# EasyEDA schematic SCH_O driver_2023-08-17.json
TITLE: Sheet_1; REV: 1.0; Date: 2023-07-29; Sheet: 1/1; Drawn By: shubhamprajapati5636; Company: Your Company
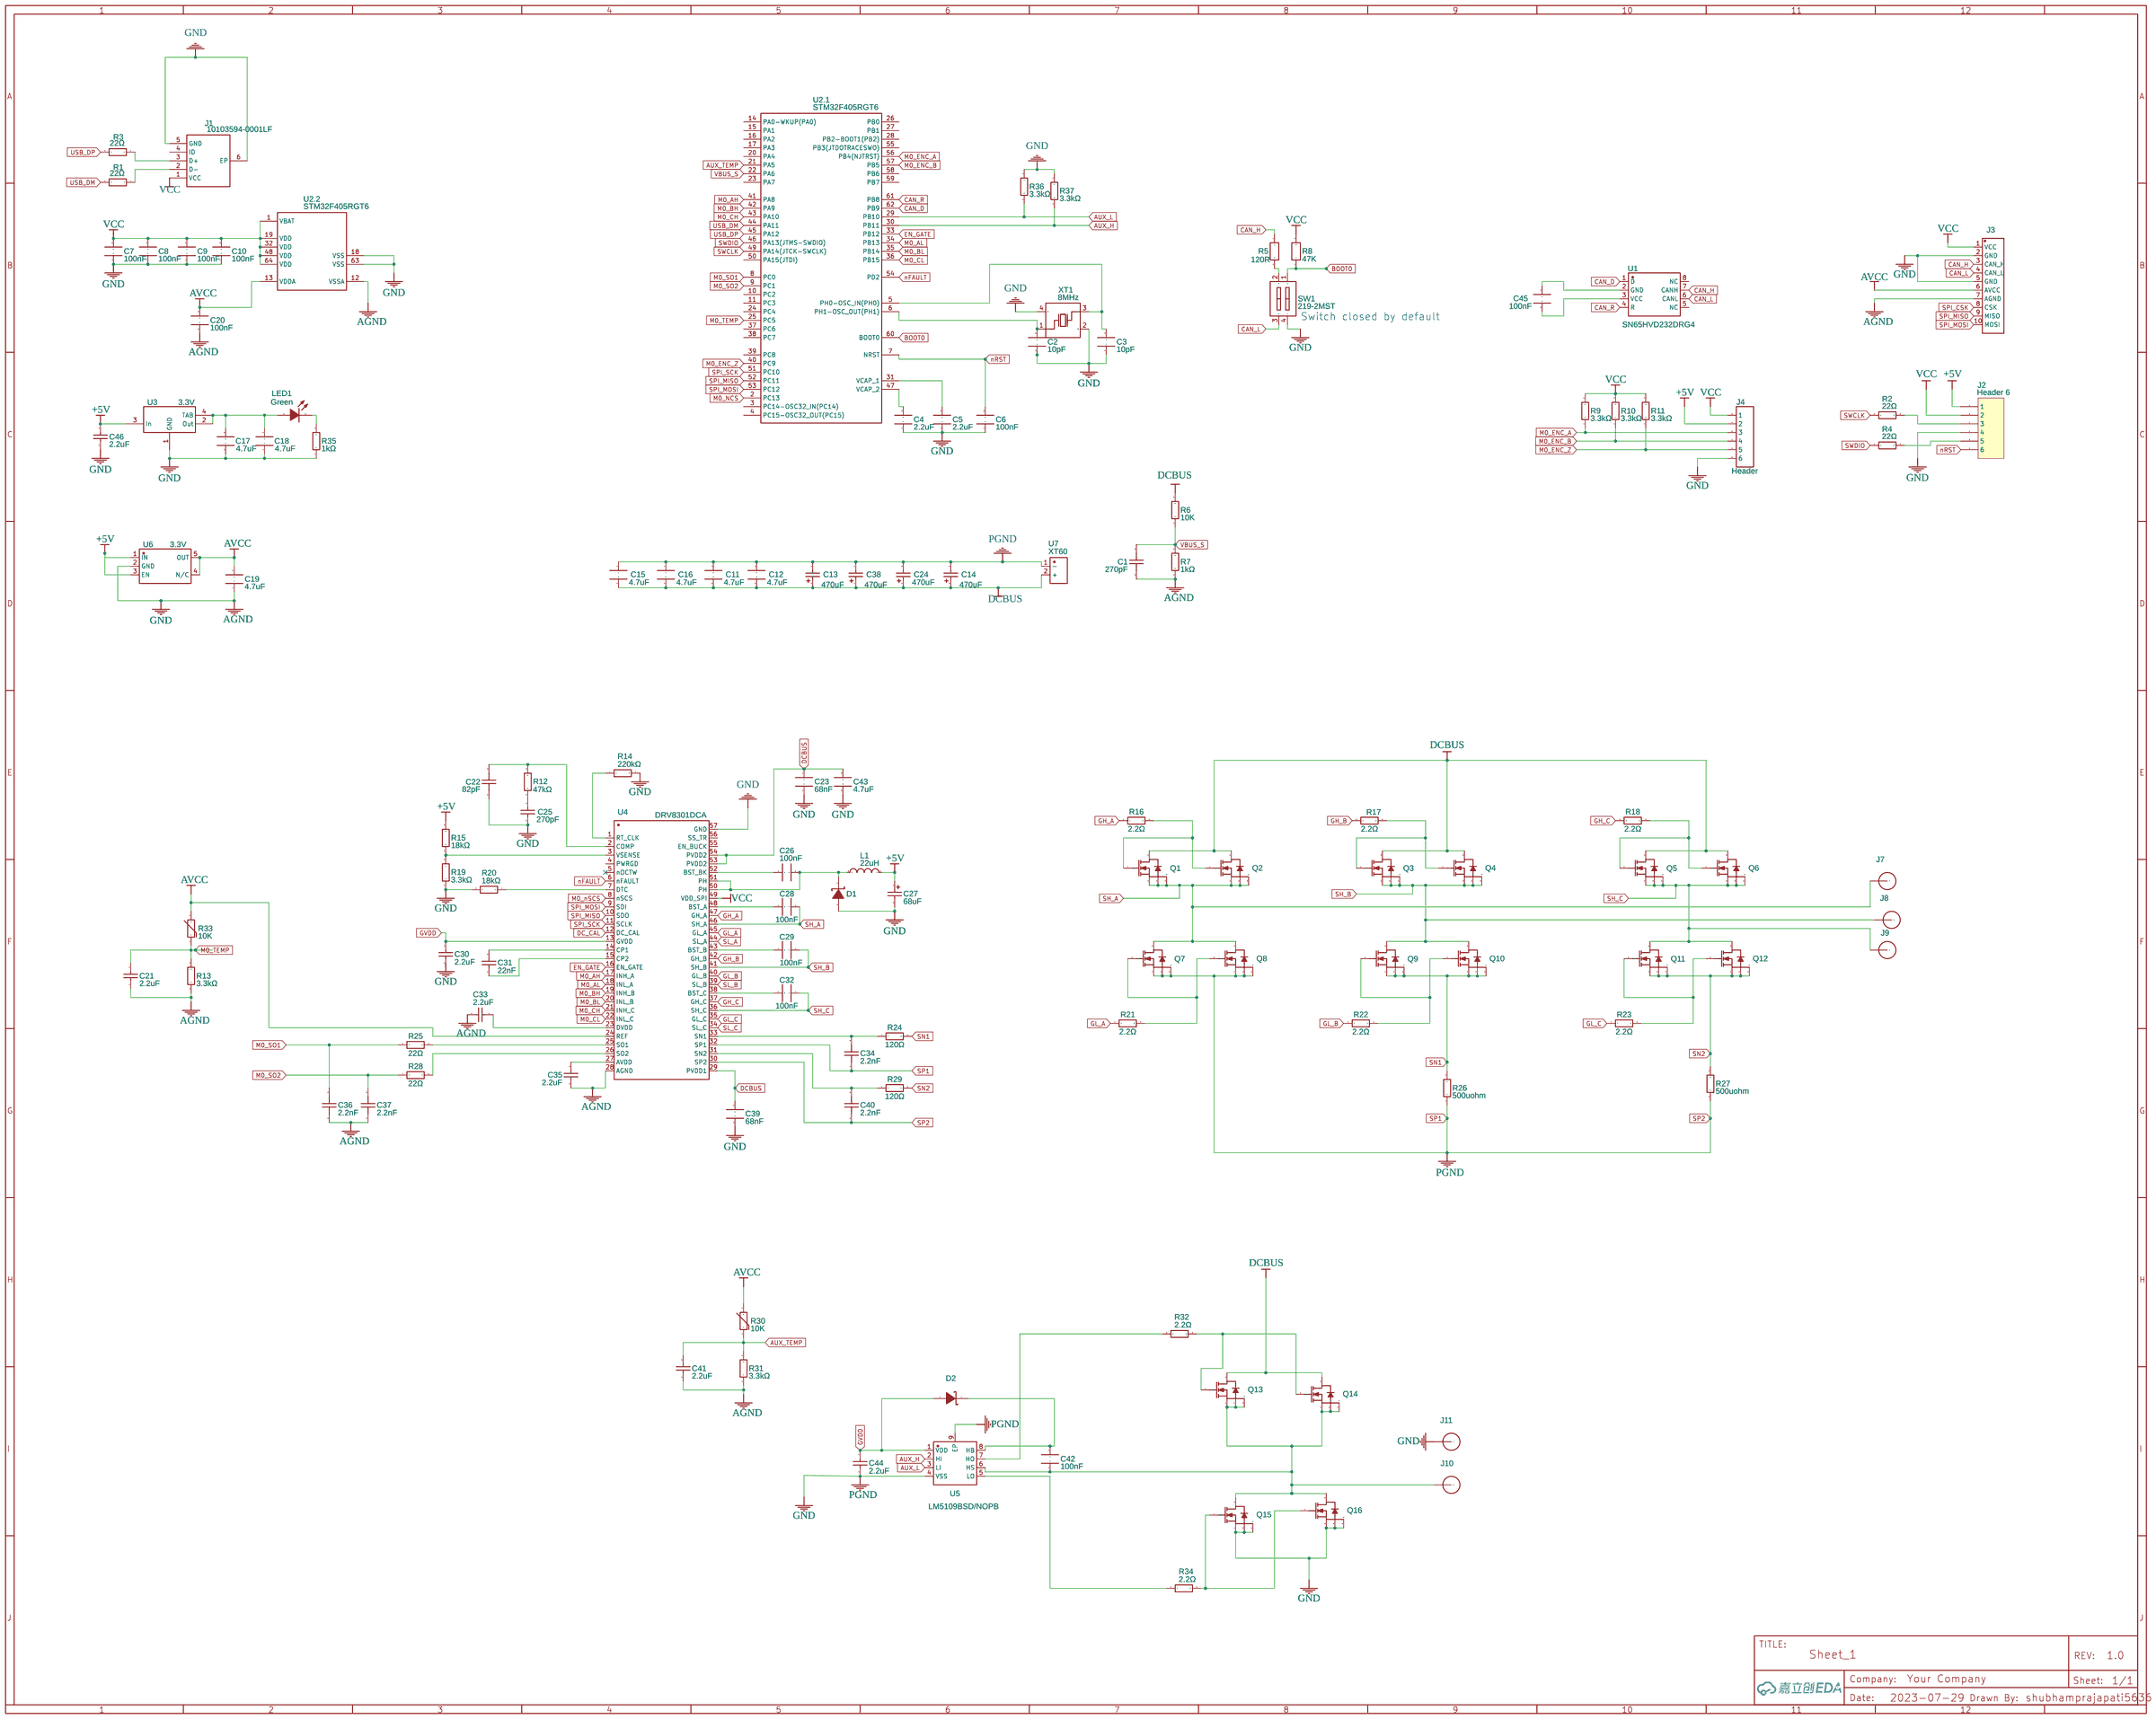
[diagram p0: schematic sheet]

## Parts
C1  270pF  [C0603]
C2  10pF  [CAPC1608X09L]
C3  10pF  [CAPC1608X09L]
C4  2.2uF  [CAPC1608X09L]
C5  2.2uF  [CAPC1608X09L]
C6  100nF  [CAPC1608X09L]
C7  100nF  [CAPC1608X09L]
C8  100nF  [CAPC1608X09L]
C9  100nF  [CAPC1608X09L]
C10  100nF  [CAPC1608X09L]
C11  4.7uF  [CAPC2012X09N]
C12  4.7uF  [CAPC2012X09N]
C13  470uF  [CAP_ELEC_SIZE_G 10.0X10.2MM]
C14  470uF  [CAP_ELEC_SIZE_G 10.0X10.2MM]
C15  4.7uF  [CAPC2012X09N]
C16  4.7uF  [CAPC2012X09N]
C17  4.7uF  [CAPC2012X09N]
C18  4.7uF  [CAPC2012X09N]
C19  4.7uF  [CAPC2012X09N]
C20  100nF  [CAPC1608X09L]
C21  2.2uF  [C0603]
C22  82pF  [C0603]
C23  68nF  [CAPC1608X09L]
C24  470uF  [CAP_ELEC_SIZE_G 10.0X10.2MM]
C25  270pF  [C0603]
C26  100nF  [CAPC1608X09L]
C27  68uF  [CAP-SMD_L6.0-W3.2-R-RD]
C28  100nF  [CAPC1608X09L]
C29  100nF  [CAPC1608X09L]
C30  2.2uF  [C0603]
C31  22nF  [C0603]
C32  100nF  [CAPC1608X09L]
C33  2.2uF  [C0603]
C34  2.2nF  [C0603]
C35  2.2uF  [C0603]
C36  2.2nF  [C0603]
C37  2.2nF  [C0603]
C38  470uF  [CAP_ELEC_SIZE_G 10.0X10.2MM]
C39  68nF  [CAPC1608X09L]
C40  2.2nF  [C0603]
C41  2.2uF  [C0603]
C42  100nF  [CAPC1608X09L]
C43  4.7uF  [CAPC2012X09N]
C44  2.2uF  [C0603]
C45  100nF  [CAPC1608X09L]
C46  2.2uF  [C0603]
D1  MBR140SFT1G  [SOD-123F_L2.8-W1.8-LS3.7-RD]
D2  MBR140SFT1G  [SOD-123F_L2.8-W1.8-LS3.7-RD]
J1  10103594-0001LF  [MICRO-USB-SMD_10103594-0001LF]
J2  Header 6  [HDR1X6]
J3  1.27mm1*10P Straight Headers  Pins  [HDR-TH_10P-P1.27-V-M-1]
J4  Header  [HDR-TH_6P-P2.54-V-M-1]
J7  M3 SCREW HOLE PAD  [M3 SPADE HOLE]
J8  M3 SCREW HOLE PAD  [M3 SPADE HOLE]
J9  M3 SCREW HOLE PAD  [M3 SPADE HOLE]
J10  M3 SCREW HOLE PAD  [M3 SPADE HOLE]
J11  M3 SCREW HOLE PAD  [M3 SPADE HOLE]
L1  22uH  [IND-SMD_L6.0-W6.0_ABG06A45]
LED1  Green  [LED0603-RD]
Q1  NTMFS5C628NLT3G  [DFN-5_L4.9-W5.9-P1.27-LS6.2-BL]
Q2  NTMFS5C628NLT3G  [DFN-5_L4.9-W5.9-P1.27-LS6.2-BL]
Q3  NTMFS5C628NLT3G  [DFN-5_L4.9-W5.9-P1.27-LS6.2-BL]
Q4  NTMFS5C628NLT3G  [DFN-5_L4.9-W5.9-P1.27-LS6.2-BL]
Q5  NTMFS5C628NLT3G  [DFN-5_L4.9-W5.9-P1.27-LS6.2-BL]
Q6  NTMFS5C628NLT3G  [DFN-5_L4.9-W5.9-P1.27-LS6.2-BL]
Q7  NTMFS5C628NLT3G  [DFN-5_L4.9-W5.9-P1.27-LS6.2-BL]
Q8  NTMFS5C628NLT3G  [DFN-5_L4.9-W5.9-P1.27-LS6.2-BL]
Q9  NTMFS5C628NLT3G  [DFN-5_L4.9-W5.9-P1.27-LS6.2-BL]
Q10  NTMFS5C628NLT3G  [DFN-5_L4.9-W5.9-P1.27-LS6.2-BL]
Q11  NTMFS5C628NLT3G  [DFN-5_L4.9-W5.9-P1.27-LS6.2-BL]
Q12  NTMFS5C628NLT3G  [DFN-5_L4.9-W5.9-P1.27-LS6.2-BL]
Q13  NTMFS5C628NLT3G  [DFN-5_L4.9-W5.9-P1.27-LS6.2-BL]
Q14  NTMFS5C628NLT3G  [DFN-5_L4.9-W5.9-P1.27-LS6.2-BL]
Q15  NTMFS5C628NLT3G  [DFN-5_L4.9-W5.9-P1.27-LS6.2-BL]
Q16  NTMFS5C628NLT3G  [DFN-5_L4.9-W5.9-P1.27-LS6.2-BL]
R1  22Ω  [R0603]
R2  22Ω  [R0603]
R3  22Ω  [R0603]
R4  22Ω  [R0603]
R5  120R  [R0603]
R6  10K  [R0603]
R7  1kΩ  [R0603]
R8  47K  [R0603]
R9  3.3kΩ  [R0603]
R10  3.3kΩ  [R0603]
R11  3.3kΩ  [R0603]
R12  47kΩ  [R0603]
R13  3.3kΩ  [R0603]
R14  220kΩ  [R0603]
R15  18kΩ  [R0603]
R16  2.2Ω  [R0603]
R17  2.2Ω  [R0603]
R18  2.2Ω  [R0603]
R19  3.3kΩ  [R0603]
R20  18kΩ  [R0603]
R21  2.2Ω  [R0603]
R22  2.2Ω  [R0603]
R23  2.2Ω  [R0603]
R24  120Ω  [R0603]
R25  22Ω  [R0603]
R26  500uohm  [2512]
R27  500uohm  [2512]
R28  22Ω  [R0603]
R29  120Ω  [R0603]
R30  10K  [R0402]
R31  3.3kΩ  [R0603]
R32  2.2Ω  [R0603]
R33  10K  [R0402]
R34  2.2Ω  [R0603]
R35  1kΩ  [R0603]
R36  3.3kΩ  [R0603]
R37  3.3kΩ  [R0603]
SW1  219-2MST  [SW-SMD_219-2MST]
U1  SN65HVD232DRG4  [SOIC-8_L4.9-W3.9-P1.27-LS6.0-BL]
U2  STM32F405RGT6  [LQFP-64_L10.0-W10.0-P0.50-LS12.0-BL]  (sections 1,2)
U3  3.3V  [SOT-223-3_L6.4-W3.5-P2.30-LS7.0-BR]
U4  DRV8301DCA  [HTSSOP-56_L14.0-W6.0-P0.50-LS8.1-BL-EP]
U5  LM5109BSD/NOPB  [WSON-8_L4.0-W4.0-P0.80-TL-EP]
U6  3.3V  [SOT-23-5_L3.0-W1.7-P0.95-LS2.8-BR]
U7  XT60  [CONN-TH_XT60]
XT1  8MHz  [OSC-SMD_4P-L5.0-W3.2-BL]

## Library data of the parts
C1 = C_0603_US: Contributor: LCEDA_Lib
C2 C3 C23 C39 = GRM188R71H104KA93D: Supplier 1: Digi-Key; Supplier Part Number 1: 490-1519-2-ND; Manufacturer: Murata Electronics North America; RoHS: RoHS Compliant; Category: Capacitors; Pricing 1: 4000=0.01822, 8000=0.01663, 12000=0.01584 (USD); Packaging: Tape & Reel (TR); Capacitance: 0.1uF; Tolerance: ±10%; Voltage - Rated: 50V; Temperature Coefficient: X7R; Mounting Type: Surface Mount, MLCC; Operating Temperature: -55°C ~ 125°C; Applications: General Purpose; Package / Case: 0603 (1608 Metric); Size / Dimension: 0.063" L x 0.032" W (1.60mm x 0.80mm); Thickness (Max): 0.035" (0.90mm); ComponentLink1URL: http://www.murata.com/~/media/webrenewal/support/library/catalog/products/capacitor/mlcc/c02e.ashx?la=en-us; ComponentLink1Description: http://www.murata.com/~/media/webrenewal/support/library/catalog/products/capacitor/mlcc/c02e.ashx?la=en-us; Stock: 19812000; Part Status: Active; Supplier 2: Digi-Key; Supplier Part Number 2: 490-1519-1-ND; Pricing 2: 1=0.12, 10=0.084, 100=0.0396, 500=0.02778, 1000=0.023 (USD); Contributor: Colton Hillebrand
C4-C10 C20 C26 C28 C29 C32 C42 = GRM188R61C225KE15D: Supplier 1: Digi-Key; Supplier Part Number 1: 490-3296-1-ND; Manufacturer: Murata Electronics North America; RoHS: RoHS Compliant; Category: Capacitors; Stock 1: 1255740; Pricing 1: 1=0.12, 10=0.08, 50=0.046, 100=0.038, 250=0.032, 500=0.0268, 1000=0.022 (USD); Packaging: Cut Tape (CT); Capacitance: 2.2µF; Tolerance: ±10%; Voltage - Rated: 16V; Temperature Coefficient: X5R; Mounting Type: Surface Mount, MLCC; Operating Temperature: -55°C ~ 85°C; Applications: General Purpose; Package / Case: 0603 (1608 Metric); Size / Dimension: 0.063" L x 0.031" W (1.60mm x 0.80mm); Thickness (Max): 0.035" (0.90mm); ComponentLink1URL: http://www.murata.com/~/media/webrenewal/support/library/catalog/products/capacitor/mlcc/c02e.pdf; ComponentLink1Description: http://www.murata.com/~/media/webrenewal/support/library/catalog/products/capacitor/mlcc/c02e.pdf; Contributor: Colton Hillebrand
C11 C12 C15-C19 C43 = GRM219R6YA475KA73D: Supplier 1: Digi-Key; Supplier Part Number 1: 490-7208-2-ND; Manufacturer: Murata Electronics North America; RoHS: RoHS Compliant; Category: Capacitors; Pricing 1: 4000=0.05126, 8000=0.0487, 12000=0.04613 (USD); Packaging: Tape & Reel (TR); Part Status: Active; Tolerance: ±10%; Voltage - Rated: 35V; Temperature Coefficient: X5R; Operating Temperature: -55°C ~ 85°C; Features: Derating Recommended; Applications: General Purpose; Mounting Type: Surface Mount, MLCC; Package / Case: 0805 (2012 Metric); Size / Dimension: 0.079" L x 0.049" W (2.01mm x 1.25mm); Thickness (Max): 0.037" (0.95mm); ComponentLink1URL: http://www.murata.com/~/media/webrenewal/support/library/catalog/products/capacitor/mlcc/c02e.ashx?la=en-us; ComponentLink1Description: http://www.murata.com/~/media/webrenewal/support/library/catalog/products/capacitor/mlcc/c02e.ashx?la=en-us; Supplier 2: Digi-Key; Supplier Part Number 2: 490-7208-1-ND; Pricing 2: 1=0.26, 10=0.177, 100=0.1002, 500=0.07076, 1000=0.06191 (USD); Stock: 152000; Contributor: Colton Hillebrand
C13 C14 C24 C38 = Cap Alu: Contributor: Suhaimi Annuar
C21 C41 C46 = EMK107BJ225KA-T: Supplier: LCSC; Manufacturer: TAIYO YUDEN(太诱); Supplier Part: C92760; JLCPCB Part Class: Extended Part
C22 = GRM1885C2A820JA01D: Contributor: LCSC; Supplier: LCSC; Supplier Part: C184399; Manufacturer: muRata(村田); JLCPCB Part Class: Extended Part
C25 = GRM1885C1H271JA01D: Supplier: LCSC; Manufacturer: muRata(村田); Supplier Part: C97879; JLCPCB Part Class: Extended Part
C27 = T495C686M016ATE250: Contributor: LCSC; Supplier: LCSC; Manufacturer: KEMET(基美); Supplier Part: C122319; JLCPCB Part Class: Extended Part
C30 C33 C35 C44 = GRM188R61C225KE15D: Supplier: LCSC; Manufacturer: muRata(村田); Supplier Part: C77183; JLCPCB Part Class: Extended Part
C31 = GRM188R71H223KA01D: Supplier: LCSC; Manufacturer: muRata(村田); Supplier Part: C77056; JLCPCB Part Class: Extended Part
C34 C36 C37 C40 = GRM1885C1H222JA01D: Supplier: LCSC; Manufacturer: muRata(村田); Supplier Part: C77033; JLCPCB Part Class: Extended Part
C45 = GRM1885C1H100JA01D: Supplier 1: Digi-Key; Supplier Part Number 1: 490-1403-1-ND; Manufacturer: Murata Electronics North America; RoHS: RoHS Compliant; Category: Capacitors; Stock 1: 450321; Pricing 1: 1=0.1, 10=0.041, 50=0.0222, 100=0.0187, 250=0.01532, 500=0.0131, 1000=0.0102 (USD); Packaging: Cut Tape (CT); Capacitance: 10pF; Tolerance: ±5%; Voltage - Rated: 50V; Temperature Coefficient: C0G, NP0; Mounting Type: Surface Mount, MLCC; Operating Temperature: -55°C ~ 125°C; Applications: General Purpose; Package / Case: 0603 (1608 Metric); Size / Dimension: 0.063" L x 0.031" W (1.60mm x 0.80mm); Thickness (Max): 0.035" (0.90mm); ComponentLink1URL: http://www.murata.com/~/media/webrenewal/support/library/catalog/products/capacitor/mlcc/c02e.pdf; ComponentLink1Description: http://www.murata.com/~/media/webrenewal/support/library/catalog/products/capacitor/mlcc/c02e.pdf; Contributor: Colton Hillebrand
D1 D2 = MBR140SFT1G: Contributor: LCSC; Supplier: LCSC; Manufacturer: onsemi(安森美); Supplier Part: C43381; JLCPCB Part Class: Extended Part
J1 = 10103594-0001LF: Contributor: LCSC; Supplier: LCSC; Supplier Part: C428495; Manufacturer: Amphenol; JLCPCB Part Class: Extended Part
J2 = Header 6: Contributor: Scott Lee
J3 = 1.27mm1*10P Straight Headers  Pins: Supplier Part: C28952; Supplier: LCSC; Manufacturer: BOOMELE(博穆精密); JLCPCB Part Class: Extended Part
J4 = Header-Male-2.54_1x6: Supplier: LCSC; Manufacturer: BOOMELE(博穆精密); Supplier Part: C37208; JLCPCB Part Class: Extended Part
J7-J11 = M3 SCREW HOLE PAD: Contributor: Colton Hillebrand
L1 = NR6028T220M: Contributor: LCSC; Supplier: LCSC; Supplier Part: C45737; Manufacturer: TAIYO YUDEN(太诱); JLCPCB Part Class: Extended Part
LED1 = LTST-C190KGKT: Contributor: LCSC; Supplier: LCSC; Manufacturer: LITEON(光宝); Supplier Part: C125094; JLCPCB Part Class: Extended Part
Q1-Q16 = NTMFS5C628NLT3G: Contributor: LCSC; Supplier: LCSC; Supplier Part: C604443; Manufacturer: onsemi(安森美); JLCPCB Part Class: Extended Part
R1-R4 R25 R28 = RC0603FR-0722RL: Supplier: LCSC; Manufacturer: YAGEO(国巨); Supplier Part: C107701; JLCPCB Part Class: Extended Part
R5 R8 = R_0603_EU: Contributor: LCEDA_Lib
R6 R15 R20 = RC0603FR-0718KL: Supplier: LCSC; Manufacturer: YAGEO(国巨); Supplier Part: C114610; JLCPCB Part Class: Extended Part
R7 R35 = RC0603FR-071KL: Supplier: LCSC; Manufacturer: YAGEO(国巨); Supplier Part: C22548; JLCPCB Part Class: Extended Part
R9-R11 R13 R19 R31 R36 R37 = RC0603FR-073K3L: Supplier: LCSC; Manufacturer: YAGEO(国巨); Supplier Part: C108078; JLCPCB Part Class: Extended Part
R12 = RC0603FR-0747KL: Supplier: LCSC; Manufacturer: YAGEO(国巨); Supplier Part: C105579; JLCPCB Part Class: Extended Part
R14 = RC0603FR-07220KL: Supplier: LCSC; Manufacturer: YAGEO(国巨); Supplier Part: C123420; JLCPCB Part Class: Extended Part
R16-R18 R21-R23 R32 R34 = RC0603FR-072R2L: Supplier: LCSC; Manufacturer: YAGEO(国巨); Supplier Part: C112307; JLCPCB Part Class: Extended Part
R24 R29 = RC0603FR-07120RL: Supplier: LCSC; Manufacturer: YAGEO(国巨); Supplier Part: C114640; JLCPCB Part Class: Extended Part
R26 R27 = CSR2512C0R0005F: Supplier: Digi-Key; Supplier Part: 696-1183-1-ND; Manufacturer: Riedon; Contributor: LCSC
R30 R33 = NCP15XH103F03RC: Supplier: LCSC; Manufacturer: muRata(村田); Supplier Part: C77131; JLCPCB Part Class: Extended Part
SW1 = 219-2MST: Contributor: LCSC; Supplier: LCSC; Supplier Part: C314502; Manufacturer: CTS(西迪斯); JLCPCB Part Class: Extended Part
U1 = SN65HVD232DRG4: Contributor: LCSC; Supplier: LCSC; Supplier Part: C2671240; Manufacturer: TI(德州仪器); JLCPCB Part Class: Extended Part
U2 = STM32F405RGT6: tags: STM32; subpart_no: 1; image: http://image.lceda.cn/szlcsc/C15742.jpg; Supplier Part: C15742; Supplier: LCSC; Manufacturer: ST(意法半导体); JLCPCB Part Class: Extended Part
U3 = 1117-3.3: Contributor: lcsc; Supplier: LCSC; Supplier Part: C5125088; Manufacturer: IDCHIP(英锐芯); JLCPCB Part Class: Extended Part
U4 = DRV8301DCA: Contributor: LCSC; Supplier: LCSC; Supplier Part: C92113; Manufacturer: TI(德州仪器); JLCPCB Part Class: Extended Part
U5 = LM5109BSD/NOPB: Contributor: LCSC; Supplier: LCSC; Supplier Part: C544701; Manufacturer: TI(德州仪器); JLCPCB Part Class: Extended Part
U6 = LP5907MFX-3.3/NOPB: Contributor: LCSC; Supplier: LCSC; Supplier Part: C80670; Manufacturer: TI(德州仪器); JLCPCB Part Class: Extended Part
U7 = XT60: Contributor: lcsc; Supplier: LCSC; Supplier Part: C98733; Manufacturer: AMASS(艾迈斯); JLCPCB Part Class: Extended Part
XT1 = ABM3B-8.000MHZ-10-1-U-T: Contributor: LCSC; Supplier: LCSC; Supplier Part: C276420; Manufacturer: ABRACON; JLCPCB Part Class: Extended Part

## Nets
+5V: C27.1 C46.2 J2.1 J4.2 L1.2 R15.2 U3.3(In) U6.1(IN) U6.3(EN)
AGND: C1.2 C2.1 C3.1 C4.1 C5.1 C6.1 C7.1 C8.1 C9.1 C10.1 C11.1 C12.1 C13.2 C14.2 C15.1 C16.1 C17.1 C18.1 C19.1 C20.1 C21.1 C22.1 C23.1 C24.2 C25.1 C27.2 C30.1 C33.2 C34.1 C35.2 C36.1 C37.1 C38.2 C39.1 C40.1 C41.1 C43.1 C44.1 C46.1 D1.2(A) J1.5(GND) J1.6(EP) J2.4 J3.2(GND) J3.5(GND) J3.7(AGND) J4.6 J11.1 Q7.1(S) Q7.2(S) Q7.3(S) Q8.1(S) Q8.2(S) Q8.3(S) Q15.1(S) Q15.2(S) Q15.3(S) Q16.1(S) Q16.2(S) Q16.3(S) R7.1 R13.1 R14.2 R19.1 R20.2 R26.1 R27.1 R31.1 R35.1 R36.2 R37.2 SW1.4 U2.12(VSSA) U2.18(VSS) U2.63(VSS) U3.1(GND) U4.28(AGND) U4.30(SP2) U4.32(SP1) U4.57(GND) U5.4(VSS) U5.9(EP) U6.2(GND) U7.1(-) XT1.2(GND) XT1.4(GND)
AVCC: C19.2 C20.2 J3.6(AVCC) R30.2 R33.2 U2.13(VDDA) U4.24(REF) U6.4(N/C) U6.5(OUT)
VBUS_S: C1.1 R6.1 R7.2 U2.22(PA6)
VCC: C7.2 C8.2 C9.2 C10.2 J1.1(VCC) J2.2 J3.1(VCC) J4.1 R8.2 R9.2 R10.2 R11.2 U2.1(VBAT) U2.19(VDD) U2.32(VDD) U2.48(VDD) U2.64(VDD) U4.49(VDD_SPI)
AUX_H: R37.1 U2.30(PB11) U5.2(HI)
AUX_L: R36.1 U2.29(PB10) U5.3(LI)
AUX_TEMP: C41.2 R30.1 R31.2 U2.21(PA5)
BOOT0: R8.1 SW1.1 U2.60(BOOT0)
CAN_D: U1.1(D) U2.62(PB9)
CAN_H: J3.3(CAN_H) R5.1 U1.7(CANH)
CAN_L: J3.4(CAN_L) SW1.3 U1.6(CANL)
CAN_R: U1.4(R) U2.61(PB8)
DC_CAL: U4.12(DC_CAL)
DCBUS: C11.2 C12.2 C13.1 C14.1 C15.2 C16.2 C23.2 C24.1 C38.1 C39.2 C43.2 Q1.5(D) Q2.5(D) Q3.5(D) Q4.5(D) Q5.5(D) Q6.5(D) Q13.5(D) Q14.5(D) R6.2 U4.29(PVDD1) U4.53(PVDD2) U4.54(PVDD2) U7.2(+)
EN_GATE: U2.33(PB12) U4.16(EN_GATE)
GH_A: R16.1 U4.47(GH_A)
GH_B: R17.1 U4.42(GH_B)
GH_C: R18.1 U4.37(GH_C)
GL_A: R21.1 U4.45(GL_A)
GL_B: R22.1 U4.40(GL_B)
GL_C: R23.1 U4.35(GL_C)
GVDD: C30.2 C44.2 D2.2(A) U4.13(GVDD) U5.1(VDD)
M0_AH: U2.41(PA8) U4.17(INH_A)
M0_AL: U2.34(PB13) U4.18(INL_A)
M0_BH: U2.42(PA9) U4.19(INH_B)
M0_BL: U2.35(PB14) U4.20(INL_B)
M0_CH: U2.43(PA10) U4.21(INH_C)
M0_CL: U2.36(PB15) U4.22(INL_C)
M0_ENC_A: J4.3 R9.1 U2.56(PB4(NJTRST))
M0_ENC_B: J4.4 R10.1 U2.57(PB5)
M0_ENC_Z: J4.5 R11.1 U2.40(PC9)
M0_NCS: U2.2(PC13)
M0_nSCS: U4.8(nSCS)
M0_SO1: C36.2 R25.1 U2.8(PC0)
M0_SO2: C37.2 R28.1 U2.9(PC1)
M0_TEMP: C21.2 R13.2 R33.1 U2.25(PC5)
nFAULT: U2.54(PD2) U4.6(nFAULT)
nRST: C6.2 J2.6 U2.7(NRST)
SH_A: C28.1 J7.1 Q1.1(S) Q1.2(S) Q1.3(S) Q2.1(S) Q2.2(S) Q2.3(S) Q7.5(D) Q8.5(D) U4.46(SH_A)
SH_B: C29.1 J8.1 Q3.1(S) Q3.2(S) Q3.3(S) Q4.1(S) Q4.2(S) Q4.3(S) Q9.5(D) Q10.5(D) U4.41(SH_B)
SH_C: C32.1 J9.1 Q5.1(S) Q5.2(S) Q5.3(S) Q6.1(S) Q6.2(S) Q6.3(S) Q11.5(D) Q12.5(D) U4.36(SH_C)
SL_A: U4.44(SL_A)
SL_B: U4.39(SL_B)
SL_C: U4.34(SL_C)
SN1: Q9.1(S) Q9.2(S) Q9.3(S) Q10.1(S) Q10.2(S) Q10.3(S) R24.2 R26.2
SN2: Q11.1(S) Q11.2(S) Q11.3(S) Q12.1(S) Q12.2(S) Q12.3(S) R27.2 R29.2
SPI_CSK: J3.8(CSK)
SPI_MISO: J3.9(MISO) U2.52(PC11) U4.10(SDO)
SPI_MOSI: J3.10(MOSI) U2.53(PC12) U4.9(SDI)
SPI_SCK: U2.51(PC10) U4.11(SCLK)
SWCLK: R2.1 U2.49(PA14(JTCK-SWCLK))
SWDIO: R4.1 U2.46(PA13(JTMS-SWDIO))
USB_DM: R1.2 U2.44(PA11)
USB_DP: R3.2 U2.45(PA12)
Net-(C2-2): C2.2 U2.6(PH1-OSC_OUT(PH1)) XT1.1(OSC1)
Net-(C3-2): C3.2 U2.5(PH0-OSC_IN(PH0)) XT1.3(OSC2)
Net-(C4-2): C4.2 U2.47(VCAP_2)
Net-(C5-2): C5.2 U2.31(VCAP_1)
Net-(C17-2): C17.2 C18.2 LED1.2(+) U3.2(Out) U3.4(TAB)
Net-(C22-2): C22.2 R12.2 U4.2(COMP)
Net-(C25-2): C25.2 R12.1
Net-(C26-1): C26.1 U4.52(BST_BK)
Net-(C26-2): C26.2 D1.1(K) L1.1 U4.50(PH) U4.51(PH)
Net-(C28-2): C28.2 U4.48(BST_A)
Net-(C29-2): C29.2 U4.43(BST_B)
Net-(C31-1): C31.1 U4.14(CP1)
Net-(C31-2): C31.2 U4.15(CP2)
Net-(C32-2): C32.2 U4.38(BST_C)
Net-(C33-1): C33.1 U4.23(DVDD)
Net-(C34-2): C34.2 R24.1 U4.33(SN1)
Net-(C35-1): C35.1 U4.27(AVDD)
Net-(C40-2): C40.2 R29.1 U4.31(SN2)
Net-(C42-1): C42.1 J10.1 Q13.1(S) Q13.2(S) Q13.3(S) Q14.1(S) Q14.2(S) Q14.3(S) Q15.5(D) Q16.5(D) U5.6(HS)
Net-(C42-2): C42.2 D2.1(K) U5.8(HB)
Net-(C45-1): C45.1 U1.3(VCC)
Net-(C45-2): C45.2 U1.2(GND)
Net-(J1-2): J1.2(D-) R1.1
Net-(J1-3): J1.3(D+) R3.1
Net-(J2-3): J2.3 R2.2
Net-(J2-5): J2.5 R4.2
Net-(LED1-1): LED1.1(-) R35.2
Net-(Q1-4): Q1.4(G) Q2.4(G) R16.2
Net-(Q3-4): Q3.4(G) Q4.4(G) R17.2
Net-(Q5-4): Q5.4(G) Q6.4(G) R18.2
Net-(Q7-4): Q7.4(G) Q8.4(G) R21.2
Net-(Q9-4): Q9.4(G) Q10.4(G) R22.2
Net-(Q11-4): Q11.4(G) Q12.4(G) R23.2
Net-(Q13-4): Q13.4(G) Q14.4(G) R32.2
Net-(Q15-4): Q15.4(G) Q16.4(G) R34.2
Net-(R5-2): R5.2 SW1.2
Net-(R14-1): R14.1 U4.1(RT_CLK)
Net-(R15-1): R15.1 R19.2 U4.3(VSENSE)
Net-(R20-1): R20.1 U4.7(DTC)
Net-(R25-2): R25.2 U4.25(SO1)
Net-(R28-2): R28.2 U4.26(SO2)
Net-(R32-1): R32.1 U5.7(HO)
Net-(R34-1): R34.1 U5.5(LO)

Not connected (* = marked no-connect by the designer): J1 4(ID); U1 5(NC) 8(NC); U2 3(PC14-OSC32_IN(PC14)) 4(PC15-OSC32_OUT(PC15)) 10(PC2) 11(PC3) 14(PA0-WKUP(PA0)) 15(PA1) 16(PA2) 17(PA3) 20(PA4) 23(PA7) 24(PC4) 26(PB0) 27(PB1) 28(PB2-BOOT1(PB2)) 37(PC6) 38(PC7) 39(PC8) 50(PA15(JTDI)) 55(PB3(JTDOTRACESWO)) 58(PB6) 59(PB7); U4 4(PWRGD) 5(nOCTW)* 55(EN_BUCK) 56(SS_TR)

## Notes on the sheet
- Switch closed by default
